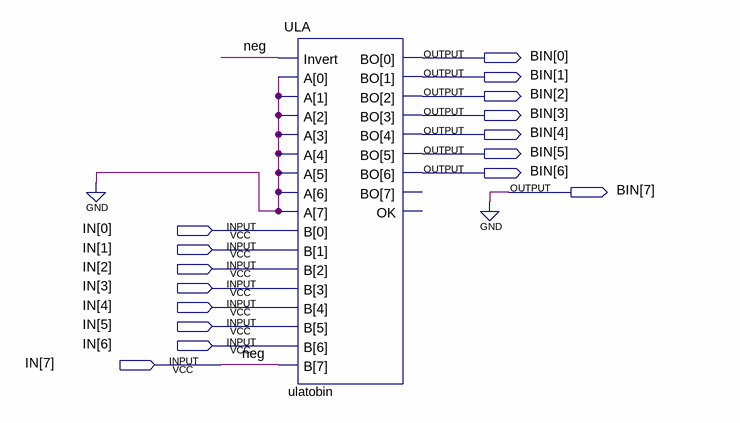
[diagram p0: schematic sheet]
// Quartus schematic Comp2ToBin.bdf as structural Verilog: 1 symbols, 16 pins
module Comp2ToBin (
  input  [7:0] IN,
  output [7:0] BIN
);
  wire [7:0] ulatobin_bo_open;  // unused outputs

  ULA ulatobin (.Invert(IN[7]), .A({8{1'b0}}), .B(IN), .BO({ulatobin_bo_open[7], BIN[6:0]}));  // open: OK

  assign BIN[7] = 1'b0;

  // Other names for the same wires on the sheet: neg = IN[7]
endmodule
